# EAGLE design mainBoard (EAGLE 9.2.2)
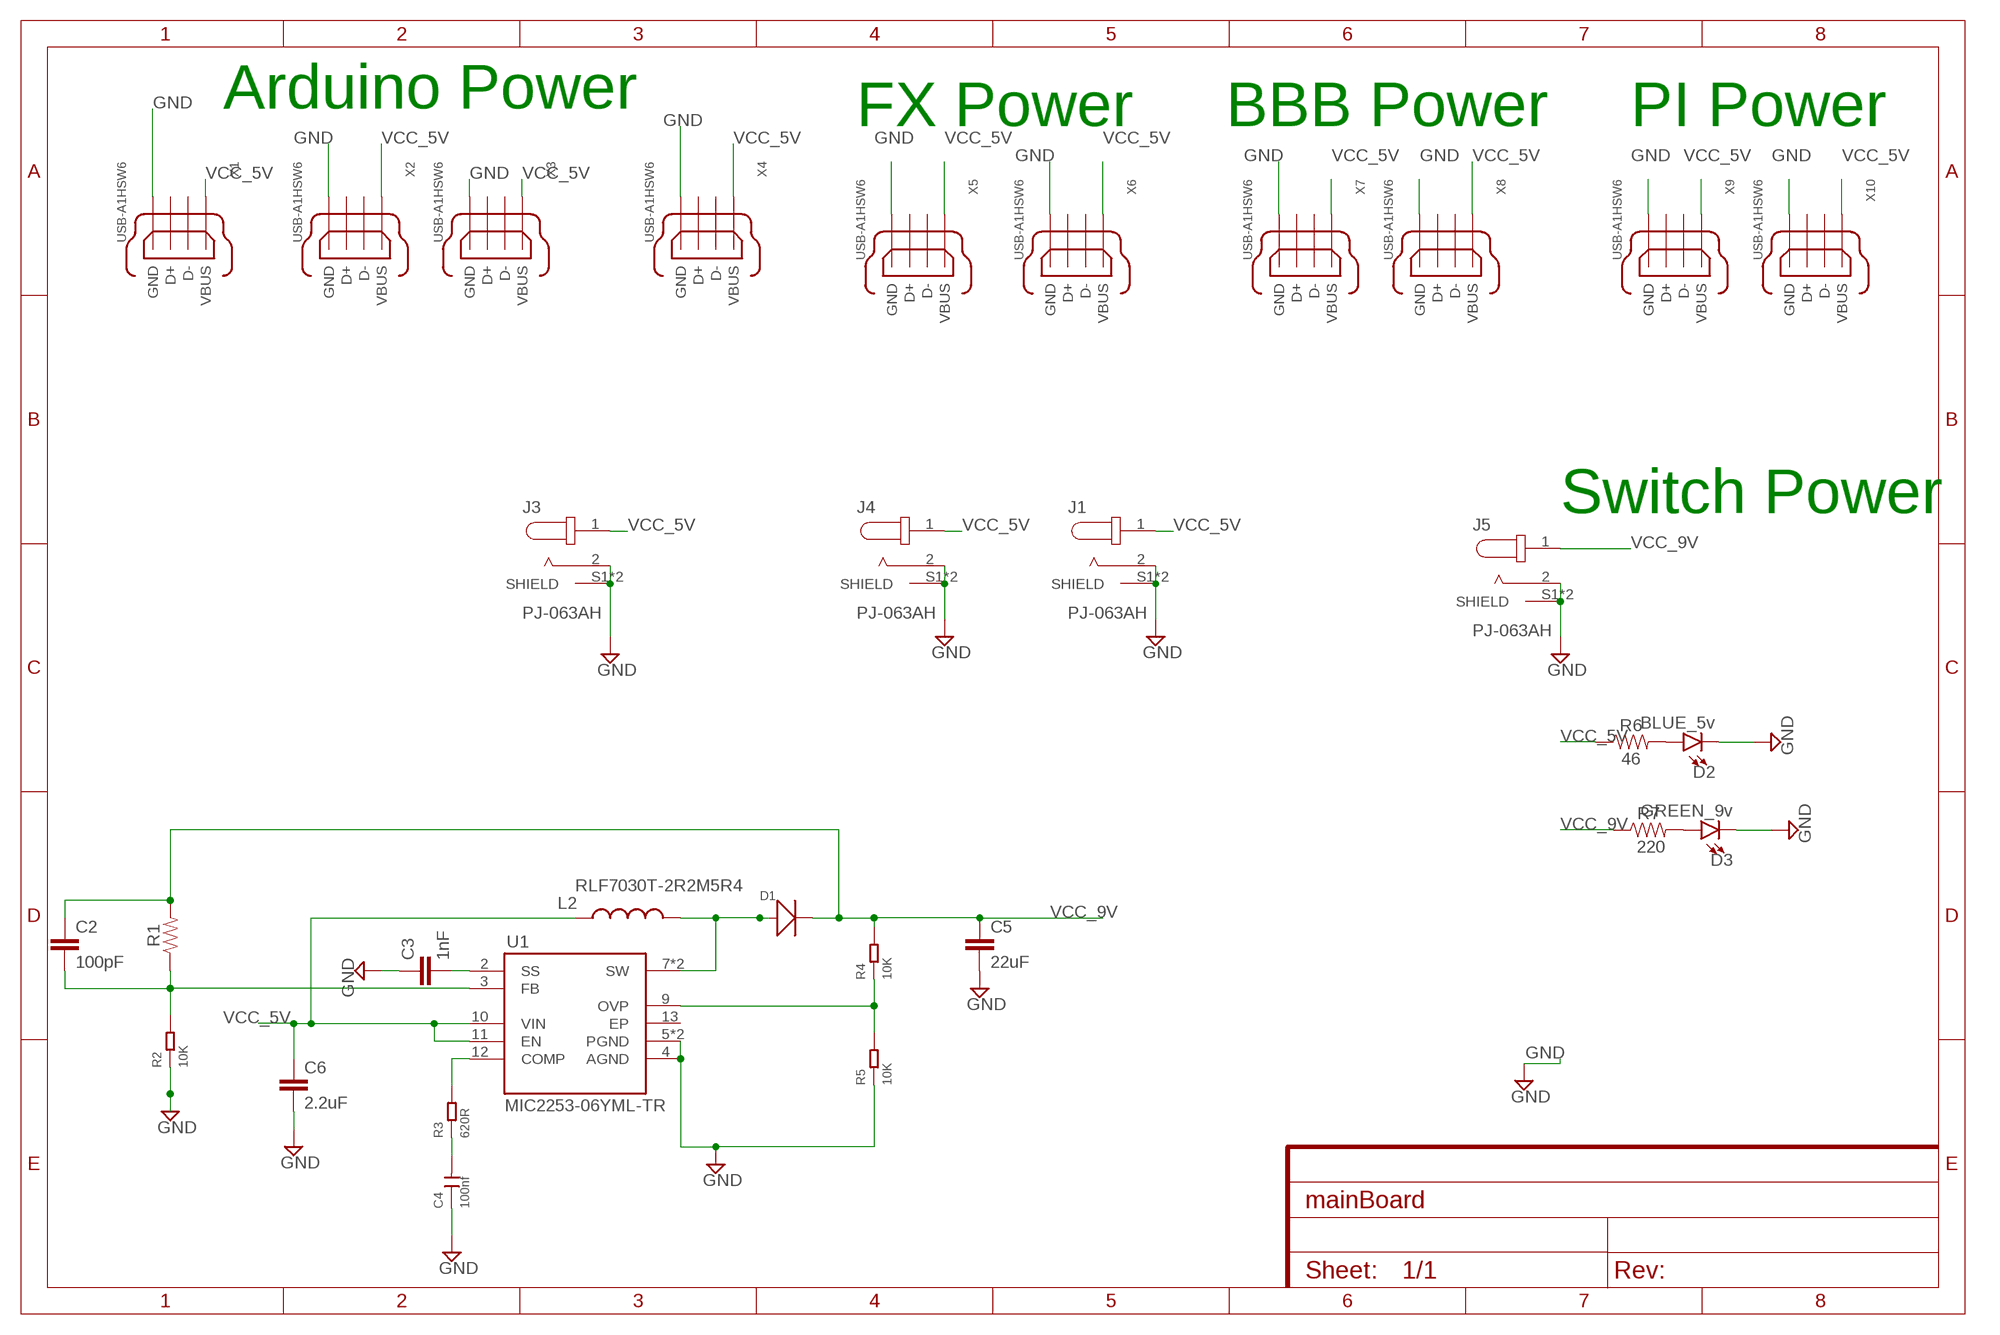
[diagram p0: schematic, sheet 1]

## Parts
C2  100pF  100PF-0603-50V-5%  [0603]
C3  1nF  1.0NF/1000PF-0603-50V-10%  [0603]
C4  100nf  CERAMIC-100NF-25V-10%-X7R(0402)  [C0402]
C5  22uF  22UF-0805-6.3V-20%  [0805]
C6  2.2uF  2.2UF-0603-10V-20%  [0603]
D1  SMD-DIODE-SCHOTTKY-28V-5A(DO-214AA)  [DO-214AA]
D2  BLUE_5v  LED-BLUE0603  [LED-0603]
D3  GREEN_9v  LED-GREEN0603  [LED-0603]
J1  PJ-063AH  [CUI_PJ-063AH]
J3  PJ-063AH  [CUI_PJ-063AH]
J4  PJ-063AH  [CUI_PJ-063AH]
J5  PJ-063AH  [CUI_PJ-063AH]
L2  RLF7030T-2R2M5R4  [INDP7368X320]
R1  62KOHM-0603-1/10W-5%  [0603]
R2  10K  SMD-RES-10K-1%-1/10W(0603)  [R0603]
R3  620R  SMD-RES-620R-5%-1/10W(0603)  [R0603]
R4  10K  SMD-RES-10K-1%-1/10W(0603)  [R0603]
R5  10K  SMD-RES-10K-1%-1/10W(0603)  [R0603]
R6  46  RESISTOR0603  [0603]
R7  220  RESISTOR0603  [0603]
U1  MIC2253-06YML-TR  [SON50P300X300X90-13N]
X1  USB-A1HSW6  [OST_USB-A1HSW6]
X2  USB-A1HSW6  [OST_USB-A1HSW6]
X3  USB-A1HSW6  [OST_USB-A1HSW6]
X4  USB-A1HSW6  [OST_USB-A1HSW6]
X5  USB-A1HSW6  [OST_USB-A1HSW6]
X6  USB-A1HSW6  [OST_USB-A1HSW6]
X7  USB-A1HSW6  [OST_USB-A1HSW6]
X8  USB-A1HSW6  [OST_USB-A1HSW6]
X9  USB-A1HSW6  [OST_USB-A1HSW6]
X10  USB-A1HSW6  [OST_USB-A1HSW6]

## Nets
GND: C3.1 C4.1 C5.2 C6.2 D2.C D3.C J1.2 J1.S1(SHIELD) J1.S2(SHIELD) J3.2 J3.S1(SHIELD) J3.S2(SHIELD) J4.2 J4.S1(SHIELD) J4.S2(SHIELD) J5.2 J5.S1(SHIELD) J5.S2(SHIELD) R2.1 R5.1 U1.4(AGND) U1.5(PGND) U1.6(PGND) X1.4(GND) X2.4(GND) X3.4(GND) X4.4(GND) X5.4(GND) X6.4(GND) X7.4(GND) X8.4(GND) X9.4(GND) X10.4(GND)
N$1: C3.2 U1.2(SS)
N$2: D2.A R6.2
N$3: R3.2 U1.12(COMP)
N$5: C4.2 R3.1
N$7: C2.2 R1.1 R2.2 U1.3(FB)
N$9: R4.1 R5.2 U1.9(OVP)
N$20: D3.A R7.2
N$21: D1.+ L2.2 U1.7(SW) U1.8(SW)
VCC_5V: C6.1 J1.1 J3.1 J4.1 L2.1 R6.1 U1.10(VIN) U1.11(EN) X1.1(VBUS) X2.1(VBUS) X3.1(VBUS) X4.1(VBUS) X5.1(VBUS) X6.1(VBUS) X7.1(VBUS) X8.1(VBUS) X9.1(VBUS) X10.1(VBUS)
VCC_9V: C2.1 C5.1 D1.- J5.1 R1.2 R4.2 R7.1
Unconnected: U1.13(EP) X1.2(D-) X1.3(D+) X2.2(D-) X2.3(D+) X3.2(D-) X3.3(D+) X4.2(D-) X4.3(D+) X5.2(D-) X5.3(D+) X6.2(D-) X6.3(D+) X7.2(D-) X7.3(D+) X8.2(D-) X8.3(D+) X9.2(D-) X9.3(D+) X10.2(D-) X10.3(D+)

## Notes on the sheet
- Arduino Power | FX Power | BBB Power | PI Power
- Switch Power

## Library data of the parts
C2 = SparkFun-Capacitors:100PF: 100pF/0.1nF ceramic capacitors A capacitor is a passive two-terminal electrical component used to store electrical energy temporarily in an electric field.; PROD_ID: CAP-07883
C3 = SparkFun-Capacitors:1.0NF/1000PF: 1nF/1,000pF ceramic capacitors A capacitor is a passive two-terminal electrical component used to store electrical energy temporarily in an electric field.; PROD_ID: CAP-07886
C4 = Seeed-Capacitor:CERAMIC-100NF-25V-10%-X7R(0402): 302010024; MPN: CC0402KRX7R8BB104
C5 = SparkFun-Capacitors:22UF: 22µF ceramic capacitors A capacitor is a passive two-terminal electrical component used to store electrical energy temporarily in an electric field.; PROD_ID: CAP-08402
C6 = SparkFun-Capacitors:2.2UF: 2.2µF ceramic capacitors A capacitor is a passive two-terminal electrical component used to store electrical energy temporarily in an electric field.; PROD_ID: CAP-07888
D1 = Seeed-Diode:SMD-DIODE-SCHOTTKY-28V-5A(DO-214AA): 304020021; MPN: SS54B; VALUE: 28V-5A
D2 = SparkFun-LED:LED-BLUE: Blue SMD LED Used in manufacturing of various products at SparkFun Packages: 0603 - SMD 0603 package [Product Link] <http://www.digikey.com/product-detail/en/SMLE12BC7TT86/511-1589-2-ND/1641808> 1206 - SMD1206 package [Product Link] <http://www.digikey.com/product-detail/en/lite-on-inc/LTST-C150TBKT/160-1643-1-ND/573584> SparkFun Products: ESP8266 Thing-Dev Board <https://www.sparkfun.com/products/13711> RedBoard <https://www.sparkfun.com/products/12757>; PROD_ID: DIO-08575; VALUE: BLUE
D3 = SparkFun-LED:LED-GREEN: Green SMD LED Used in manufacturing of various products at SparkFun Packages: 0603 - SMD 0603 package [Product Link] <http://www.futureelectronics.com/en/technologies/semiconductors/optoelectronics/leds/Pages/9894312-LTST-C190GKT.aspx?CrossPart=HSMG-C190&IM=0> LilyPad 1206 - SMD1206 LilyPad package [Product Link] <http://www.futureelectronics.com/en/Technologies/Product.aspx?ProductID=IN150NGHARVATEKCORPORATION2049943&IM=0> 1206 - SMD1206 package [Product Link] <http://www.futureelectronics.com/en/technologies/semiconductors/optoelectronics/leds/Pages/8315665-LTST-C150KGKT.aspx?IM=0> 1206 Bottom Mount -SMD 1206 Bottom Mount [Product Link] <http://www.digikey.com/product-detail/en/lite-on-inc/LTST-C230KGKT/160-1456-1-ND/386854> SparkFun Products: Pro Mini 328 -5V <https://www.sparkfun.com/products/821> RedBoard <https://www.sparkfun.com/products/12757> MP3 Trigger <https://www.sparkfun.com/products/13720> Makey Makey <https://www.sparkfun.com/products/11076>; PROD_ID: DIO-00821; VALUE: GREEN
J1 J3-J5 = PJ-063AH:PJ-063AH: 2.0 mm Center Pin, 8.0 A, Right Angle, Through Hole, Shielded, Kinked Pins, Dc Power Jack Connector; AVAILABILITY: Unavailable; CUI_PURCHASE_URL: https://www.cui.com/product/interconnect/dc-power-connectors/jacks/2.0-mm-center-pin/pj-063ah?utm_source=snapeda.com&utm_medium=referral&utm_campaign=snapedaBOM; DESCRIPTION: 2.0 mm Center Pin, 8.0 A, Right Angle, Through Hole, Shielded, Kinked Pins, Dc Power Jack Connector; MF: CUI Inc.; MP: PJ-063AH; PACKAGE: None; PRICE: None
L2 = RLF7030T-2R2M5R4:RLF7030T-2R2M5R4: Inductor Power Shielded Wirewound 4.7uH 20% 100KHz Ferrite 3.4A 31.2mOhm DCR T/R; AVAILABILITY: Unavailable; DESCRIPTION: Inductor Power Shielded Wirewound 2.2uH 20% 100KHz Ferrite 5.4A 12mOhm DCR Blister T/R; MF: TDK; MP: RLF7030T-2R2M5R4; PACKAGE: Nonstandard TDK; PRICE: None
R1 = SparkFun-Resistors:62KOHM: 62kΩ resistor A resistor is a passive two-terminal electrical component that implements electrical resistance as a circuit element. Resistors act to reduce current flow, and, at the same time, act to lower voltage levels within circuits. - Wikipedia
R2 R4 R5 = Seeed-Resistor:SMD-RES-10K-1%-1/10W(0603): 301010299; MPN: RC0603FR-0710KL
R3 = Seeed-Resistor:SMD-RES-620R-5%-1/10W(0603): 301010210; MPN: RC0603JR-07620RL
R6 R7 = SparkFun-Resistors:RESISTOR: Generic Resistor Package
U1 = MIC2253-06YML-TR:MIC2253-06YML-TR: DC-DC Switching Boost (Step Up) Regulator, Adjustable, 2.5V-10Vin, 3V-30Vout, 3.5Aout, MLF-12; DESCRIPTION: DC-DC Switching Boost _Step Up_ Regulator, Adjustable, 2.5V-10Vin, 3V-30Vout, 3.5Aout, MLF-12; DIGI-KEY_PART_NUMBER: 576-3643-1-ND; DIGI-KEY_PURCHASE_URL: https://www.digikey.se/product-detail/en/microchip-technology/MIC2253-06YML-TR/576-3643-1-ND/2339660?utm_source=snapeda&utm_medium=aggregator&utm_campaign=symbol; MF: Microchip; MP: MIC2253-06YML-TR; PACKAGE: VFDFN-12 Microchip
X1-X10 = USB-A1HSW6:USB-A1HSW6: USB - A Receptacle Connector 4 Position Through Hole, Right Angle; AVAILABILITY: Unavailable; DESCRIPTION: Conn Usb Type a r/a White; MF: On Shore; MP: USB-A1HSW6; PACKAGE: None; PRICE: None

## Board
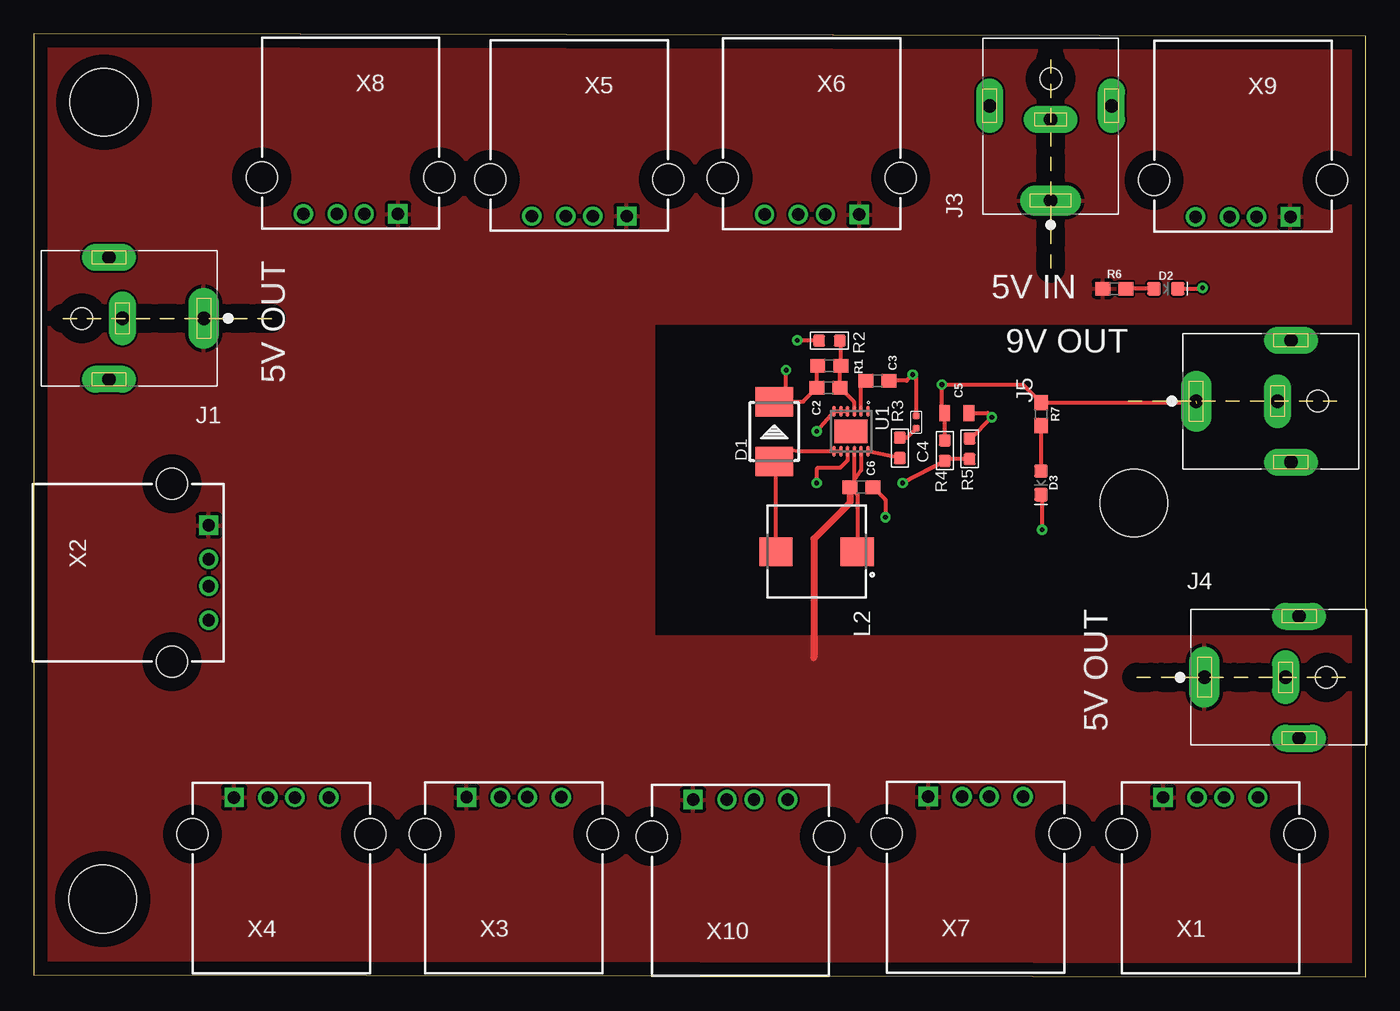
[diagram p1: board, top side]
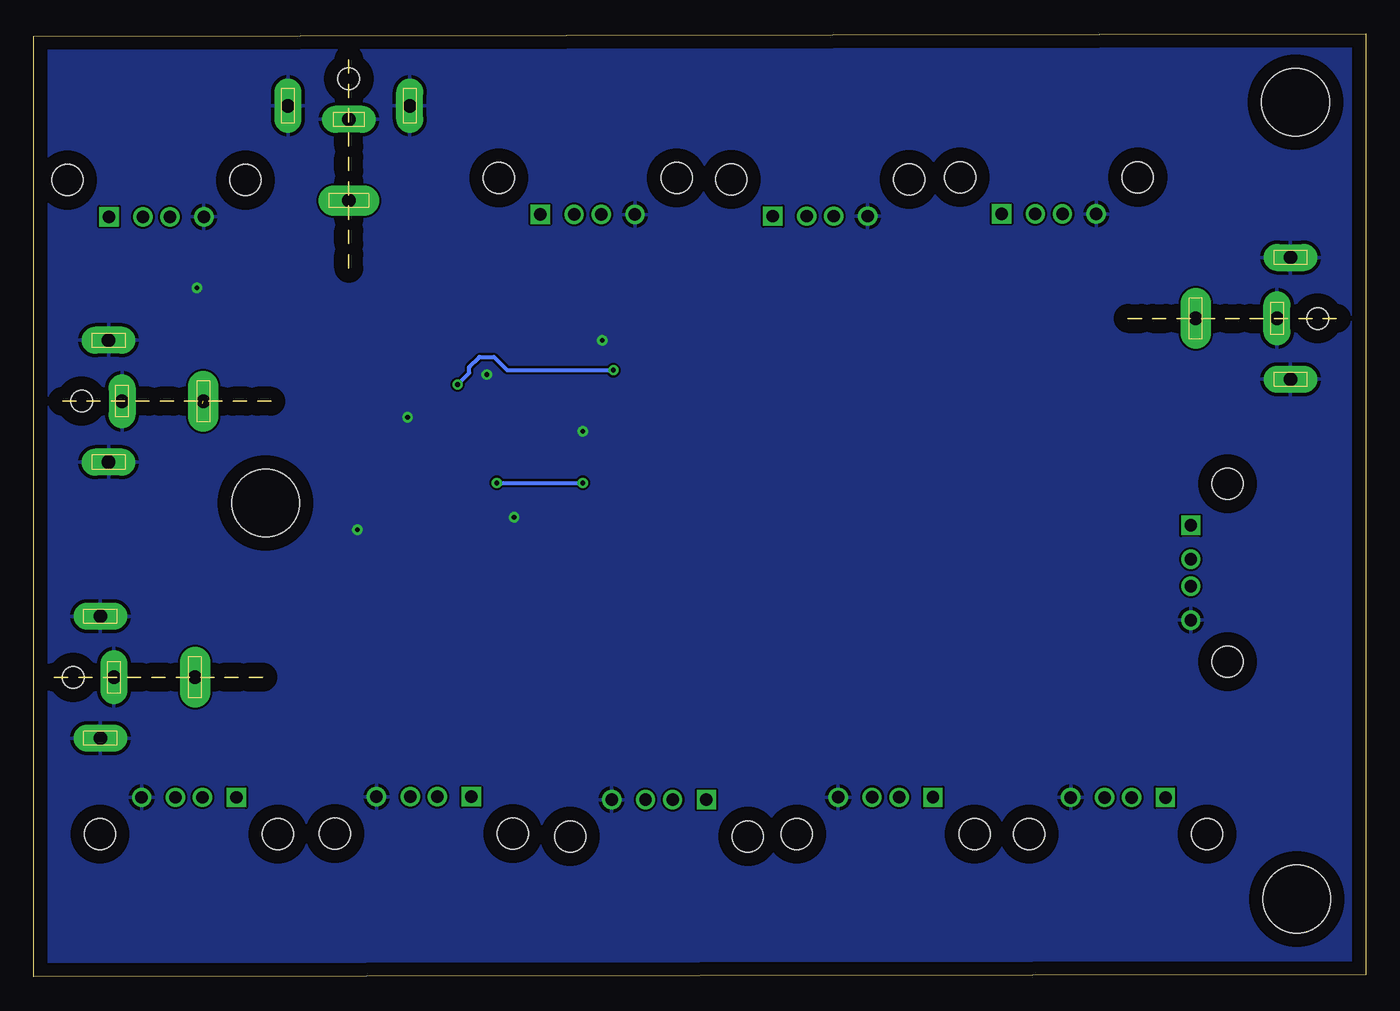
[diagram p2: board, bottom side, seen from below]

Size 98.4 x 69.68 mm. Coordinates in mm from the lower left corner, seen from the top.
Outline: 0,0.16 98.4,0 98.4,69.52 0,69.68 0,0.16
Copper layers (1*16): Top 0.035mm / dielectric 1.5mm / Bottom 0.035mm
Design rules "default": minimum track width 6mil, minimum drill 0.35mm, track to track 6mil, track to pad 6mil, pad to pad 6mil, via to via 6mil, smd to smd 6mil, copper to edge 40mil, drill to drill 6mil, minimum pad ring 10mil, minimum via ring 8mil, stop-mask expansion 4mil, vias tented up to drill 0mil, thermal gap 10mil
Holes 5 mm at 5.18,64.63 5.08,5.75 81.28,35.01

### Footprints (pad centres in the part's own frame; a part is rotated, then mirrored left to right if it is on the bottom)
0603 = smd 1.1 x 1: 1 -0.85,0; 2 0.85,0
C0402 = smd 0.5 x 0.5: 1 0,0.463; 2 0,-0.463
0805 = smd 0.8 x 1.2: 1 -0.9,0; 2 0.9,0
DO-214AA = smd 2.159 x 2.743: + -2.21,0; - 2.21,0
LED-0603 = smd 1 x 1: A -0.877,0; C 0.877,0
CUI_PJ-063AH = drill 1 pad 2.25 long: 1 0,0 | drill 1 pad 2 long: 2 6,0; S1 7,4.5; S2 7,-4.5 | hole 1.6: 9,0
INDP7368X320 = smd 2.45 x 2.1: 1 -3,0; 2 3,0
R0603 = smd 0.889 x 0.889: 1 0,0.762; 2 0,-0.762
SON50P300X300X90-13N = smd 0.8 x 0.25: 1 -1.476,1.25; 2 -1.476,0.75; 3 -1.476,0.25; 4 -1.476,-0.25; 5 -1.476,-0.75; 6 -1.476,-1.25; 7 1.476,-1.25; 8 1.476,-0.75; 9 1.476,-0.25; 10 1.476,0.25; 11 1.476,0.75; 12 1.476,1.25 | smd 1.75 x 2.45: 13 0,0
OST_USB-A1HSW6 = drill 0.92 square: 1 -3.5,6.51 | drill 0.92: 2 -1,6.51; 3 1,6.51; 4 3.5,6.51 | hole 2.3: -6.57,3.8; 6.57,3.8

### Placement (x,y rotation side)
C2  58.72,43.53 0 top
C3  62.34,44.05 180 top
C4  65.19,40.99 0 top
C5  68.19,41.67 0 top
C6  61.13,36.19 0 top
D1  54.71,40.29 90 top
D2  83.63,50.85 0 top
D3  74.41,36.5 270 top
J1  12.55,48.66 180 top
J3  75.13,57.37 90 top
J4  86.49,22.14 0 top
J5  85.88,42.54 0 top
L2  57.84,31.42 180 top
R1  58.77,45.16 180 top
R2  58.78,47.01 90 top
R3  63.98,39.09 0 top
R4  67.31,38.89 180 top
R5  69.14,39.02 0 top
R6  79.82,50.85 0 top
R7  74.41,41.58 270 top
U1  60.38,40.31 270 top
X1  86.93,6.76 0 top
X2  6.41,29.86 270 top
X3  35.47,6.76 0 top
X4  18.3,6.75 0 top
X5  40.3,62.72 180 top
X6  57.48,62.85 180 top
X7  69.58,6.8 0 top
X8  23.4,62.89 180 top
X9  89.34,62.68 180 top
X10  52.21,6.59 0 top

### Tracks (layer width: path | path; a pad name or v marks a point on that pad's centre or on a via)
GND  (via drill 0.35)
  Top 0.152: 86.29,50.85 v86.35,50.91
  Top 0.305: U1.4 U1.5 U1.6 v57.84,40.31 | C3.1 64.47,44.05 v64.94,44.52 65.19,44.26 C4.1 | v56.4,47.04 57.99,47.04 R2.1 | C5.2 70.47,41.67 v70.78,41.35 69.22,39.78 R5.1 | v74.5,33.04 74.5,35.54 D3.C | D2.C 86.29,50.85 | C6.2 62.92,35.26 v62.92,33.96
  pour Bottom: -0.31,70.01 99.03,70.01 99.03,-0.28 -0.31,-0.28
N$1
  Top 0.305: U1.2 61.13,43.69 C3.2
N$2
  Top 0.305: D2.A R6.2
N$3
  Top 0.305: R3.2 U1.12
N$5
  Top 0.305: C4.2 64.51,39.85 R3.1
N$7
  Top 0.305: U1.3 60.63,42.47 C2.2 59.57,45.11 R1.1 59.62,46.94 R2.2
N$9  (via drill 0.35)
  Top 0.305: U1.9 60.13,38.17 59.57,37.61 57.93,37.61 57.84,37.52 v57.84,36.5 | R5.2 67.52,38.26 R4.1 v64.19,36.5
  Bottom 0.305: v64.19,36.5 v57.84,36.5
N$20
  Top 0.305: R7.2 D3.A
N$21
  Top 0.305: L2.2 54.84,38.07 D1.+ 55.83,38.9 56.68,38.83 U1.7 U1.8
VCC_5V
  Top 0.305: L2.1 60.84,35.63 C6.1 | C6.1 61.13,37.42 U1.11 | C6.1 arc90 60.63,36.54 U1.10
  Top 0.508: C6.1 60.28,35.02 57.63,32.37 57.63,23.6
  pour Top: 101.88,48.32 45.75,48.32 45.75,25.14 98.74,25.14 98.74,-0.2 -0.28,-0.2 -0.28,69.95 101.88,69.95
VCC_9V  (via drill 0.35)  (1 unrouted)
  Top 0.305: R1.2 57.87,45.11 C2.1 56.84,42.49 D1.- 55.58,43.37 v55.58,44.83 | R4.2 67.29,39.66 C5.1 67.09,41.87 v67.09,43.77 73.08,43.77 74.31,42.54 | 74.61,42.55 74.67,42.49 | R7.1 85,42.43 85.05,42.38 85.93,42.38
  Top 0.508: J5.1 85.88,43.25 | 74.61,42.55 74.31,42.54 R7.1
  Bottom 0.305: v67.09,43.77 66.23,44.63 66.23,45.05 65.47,45.81 64.4,45.81 63.42,44.83 v55.58,44.83

### Text on the board
tNames: 5V IN | 9V OUT | 5V OUT | 5V OUT